# Altium project Solenoid-Switching-Board-v1.0.PrjPcb (part 2 of 5)

## Sheet Controller_Sheet.SchDoc
size 420 x 297 mm; SheetNumber: 3; SheetTotal: 9
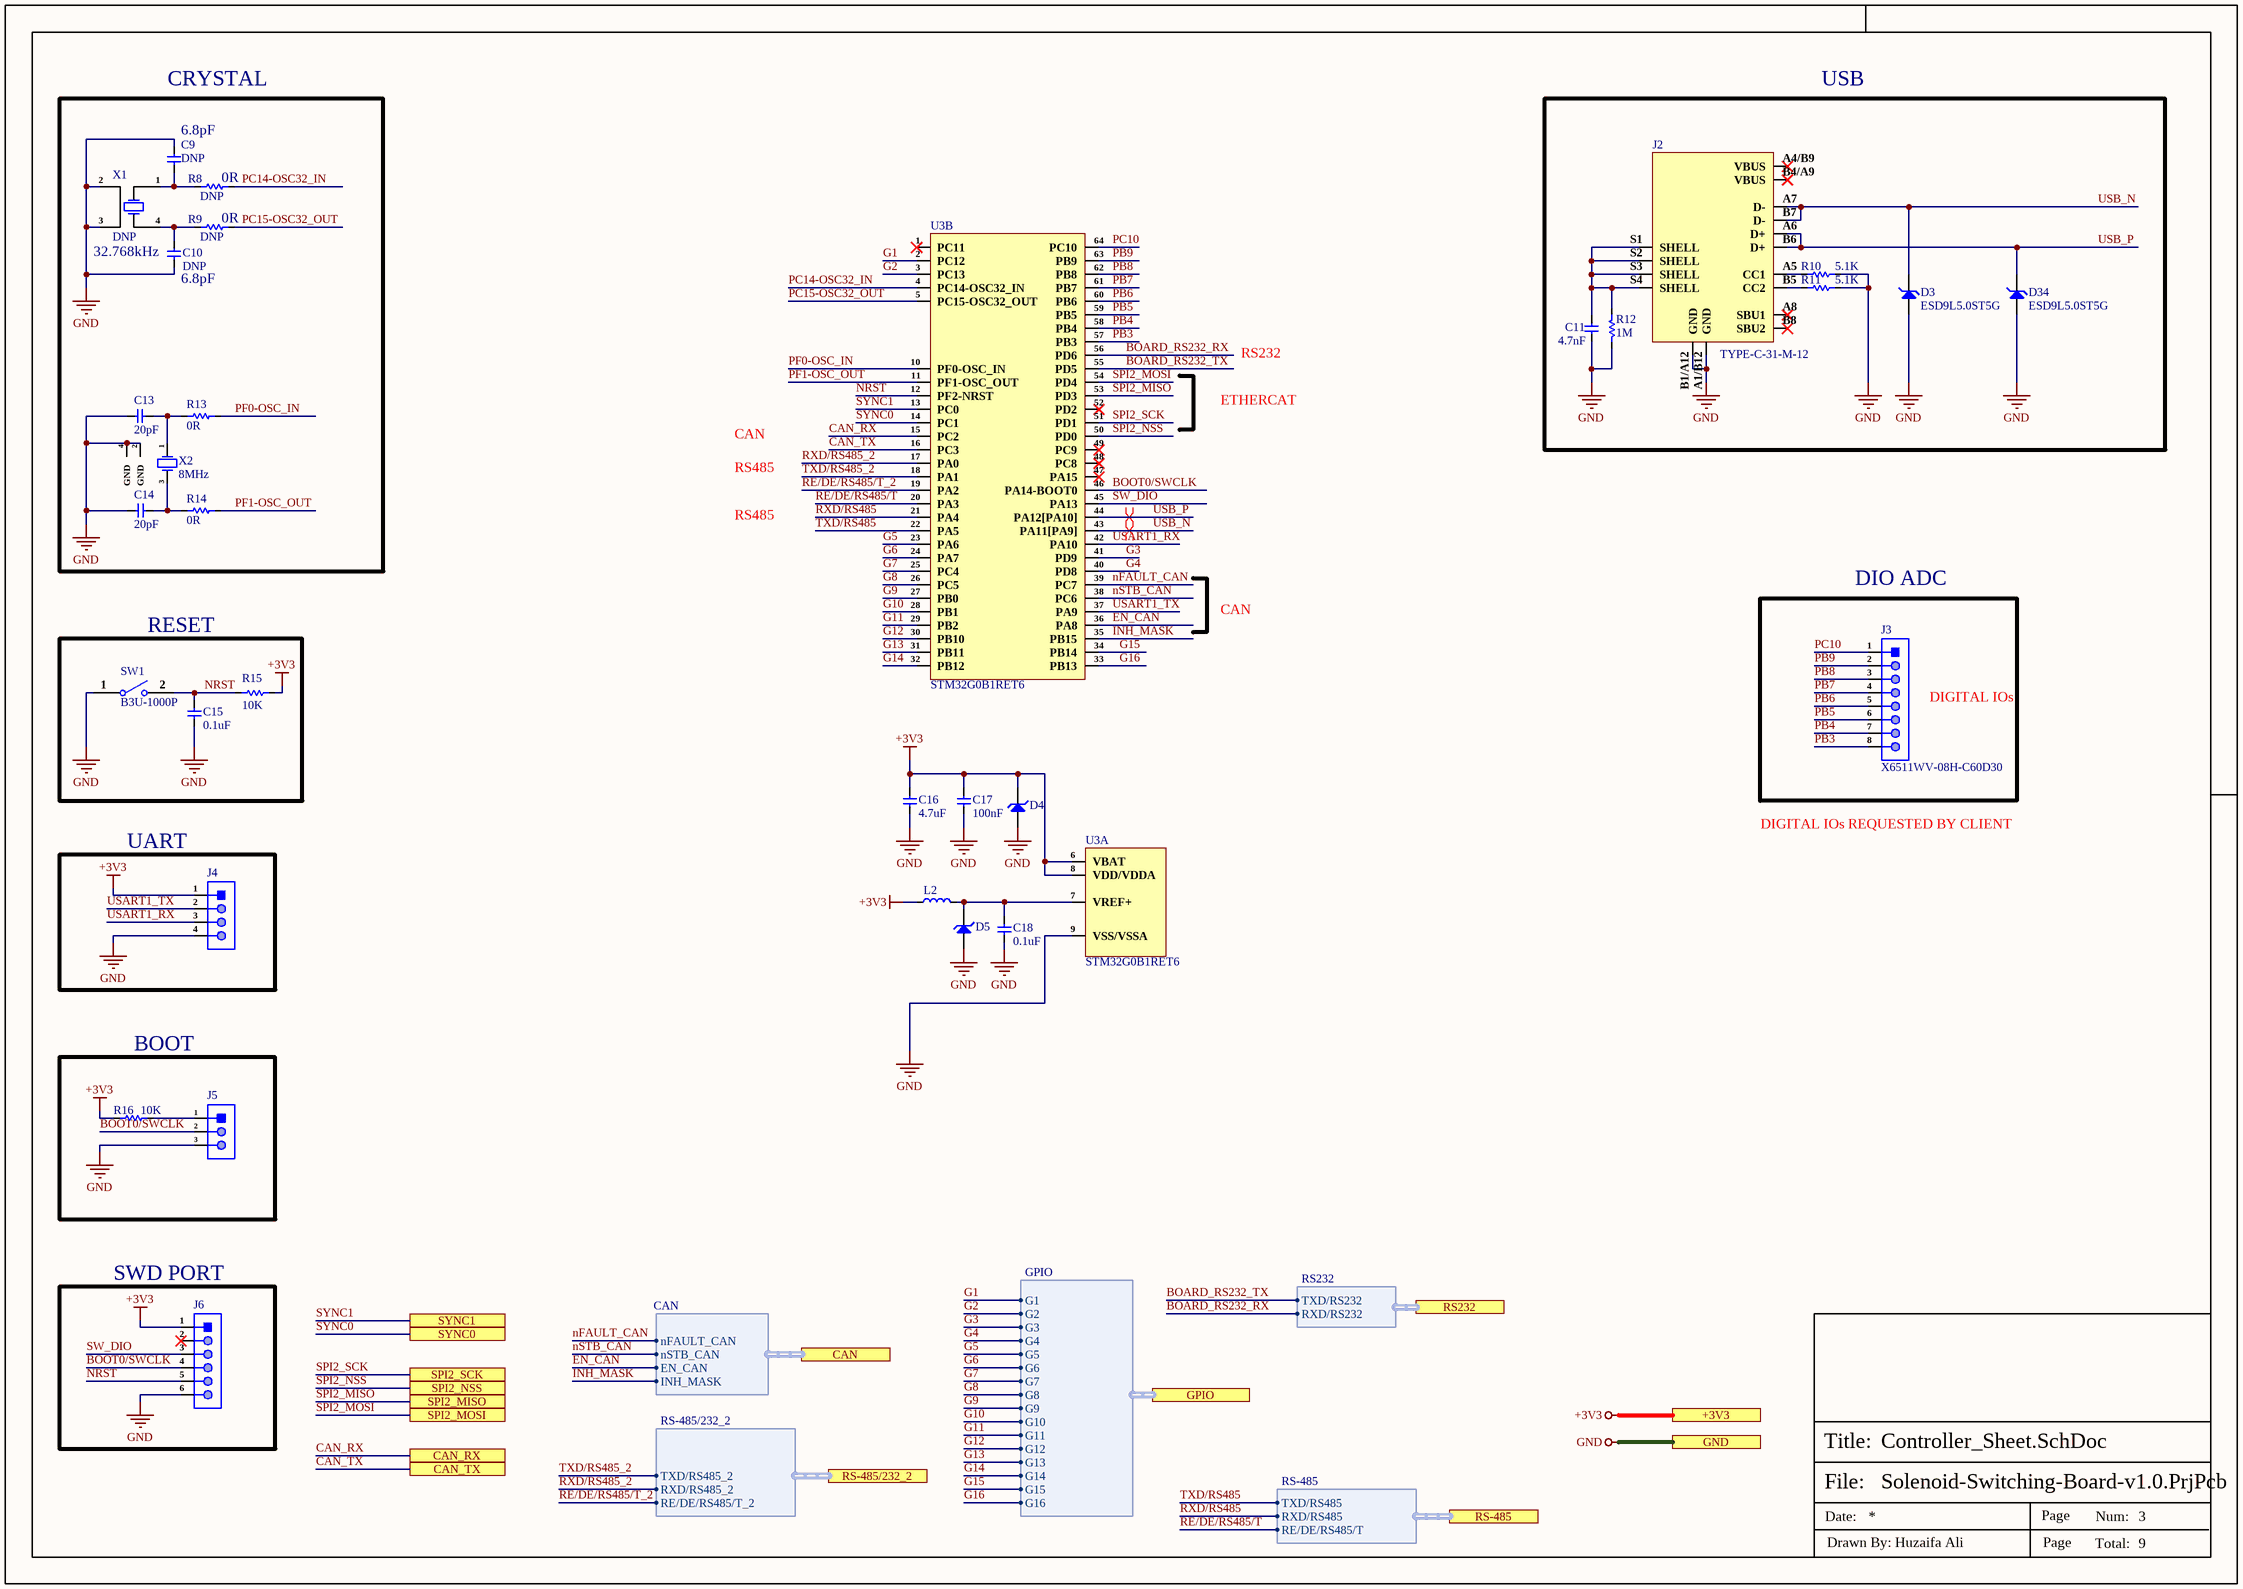
[diagram p3: Controller_Sheet.SchDoc]

### Parts
C9  DNP  [Cap-0402]
C10  DNP  [Cap-0402]
C11  4.7nF  [Cap-0603]
C13  20pF  [Cap-0402]
C14  20pF  [Cap-0402]
C15  0.1uF  [Cap-0402]
C16  4.7uF  [Cap-0402]
C17  100nF  [cap-0402]
C18  0.1uF  [Cap-0402]
D3  ESD9L5.0ST5G  [SOD-923.]
D4  AZ3003-01G  [SOD-123]  (value not drawn)
D5  AZ3003-01G  [SOD-123]  (value not drawn)
D34  ESD9L5.0ST5G  [SOD-923.]
J2  TYPE-C-31-M-12  [TYPE-C-31-M-12_]
J3  X6511WV-08H-C60D30  [HDR 1x8 TH male]
J4  X6511WV-04H-C60D30  [HDR1X4_]  (value not drawn)
J5  68000-103HLF  [HDR1X3_]  (value not drawn)
J6  X6511WV-06H-C60D30  [HDR1X6_]  (value not drawn)
L2  BLM15AG601SN1D  [IND-0402]  (value not drawn)
R8  DNP  [Res-0603]
R9  DNP  [Res-0603]
R10  5.1K  [Res-0402]
R11  5.1K  [Res-0402]
R12  1M  [Res-0402]
R13  0R  [Res-0603]
R14  0R  [Res-0603]
R15  10K  [Res-0402]
R16  10K  [Res-0402]
SW1  B3U-1000P  [B3U-1000P]
U3  STM32G0B1RET6  [LQFP-64(10x10)]  (parts A,B of 2)
X1  DNP  [MC-306]
X2  8MHz  [5TJ480000XYLBC_]

### Blocks framed on the sheet
CRYSTAL: C9 C10 C13 C14 R8 R9 R13 R14 X1 X2
USB: C11 D3 D34 J2 R10-R12
RESET: C15 R15 SW1
DIO ADC: J3
UART: J4
BOOT: J5 R16
SWD PORT: J6

### Ports
+3V3 (see Top_Sheet[3A], CAN_Sheet[5D], Connector_Sheet[5D], EtherCAT_Sheet[5D], Power_Sheet[5D], RJ45_Sheet[5D], RS485_RS232_Sheet[5D]), CAN (harness CAN, see Top_Sheet[3B], CAN_Sheet[4D]), CAN_RX (see Top_Sheet[3B], CAN_Sheet[3D]), CAN_TX (see Top_Sheet[3B], CAN_Sheet[3D]), GND (see Top_Sheet[3A], CAN_Sheet[5D], Connector_Sheet[5D], EtherCAT_Sheet[5D], MOSFET_Sheet[5D], Power_Sheet[5D], RJ45_Sheet[5D], RS485_RS232_Sheet[5D]), GPIO (harness GPIO, see Top_Sheet[3B], MOSFET_Sheet[3D]), RS232 (harness RS232, see Top_Sheet[3B], RS485_RS232_Sheet[4D]), RS-485 (harness RS-485, see Top_Sheet[3B], RS485_RS232_Sheet[4D]), RS-485/232_2 (harness RS-485/232_2, see Top_Sheet[3B], RS485_RS232_Sheet[3D]), SPI2_MISO (see Top_Sheet[3A], EtherCAT_Sheet[2D]), SPI2_MOSI (see Top_Sheet[3B], EtherCAT_Sheet[2D]), SPI2_NSS (see Top_Sheet[3A], EtherCAT_Sheet[2D]), SPI2_SCK (see Top_Sheet[3A], EtherCAT_Sheet[2D]), SYNC0 (see Top_Sheet[3B], EtherCAT_Sheet[1D]), SYNC1 (see Top_Sheet[3B], EtherCAT_Sheet[1D])

### Harnesses
RS-485/232_2: TXD/RS485_2, RXD/RS485_2, RE/DE/RS485/T_2
RS232: TXD/RS232, RXD/RS232
RS-485: TXD/RS485, RXD/RS485, RE/DE/RS485/T
CAN: nFAULT_CAN, nSTB_CAN, EN_CAN, INH_MASK
GPIO: G1, G2, G3, G4, G5, G6, G7, G8, G9, G10, G11, G12, G13, G14, G15, G16

### Nets
+3V3: C16.2 C17.2 D4.2(K) J4.1 J6.1 L2.1 R15.2 R16.2 U3.6(VBAT) U3.8(VDD/VDDA) ; port +3V3
CAN_RX: U3.15(PC2) ; port CAN_RX
CAN_TX: U3.16(PC3) ; port CAN_TX
GND: C9.1 C10.2 C11.1 C13.1 C14.2 C15.1 C16.1 C17.1 C18.1 D3.2(A) D4.1(A) D5.1(A) D34.2(A) J2.A1/B12(GND) J2.B1/A12(GND) J4.4 J5.3 J6.6 R10.2 R11.2 R12.2 SW1.1 U3.9(VSS/VSSA) X1.2 X1.3 X2.2(GND) X2.4(GND) ; port GND
RE/DE/RS485/T: U3.20(PA3) ; port RS-485.RE/DE/RS485/T
RXD/RS485: U3.21(PA4) ; port RS-485.RXD/RS485
TXD/RS485: U3.22(PA5) ; port RS-485.TXD/RS485
BOARD_RS232_RX: U3.56(PD6) ; port RS232.RXD/RS232
BOARD_RS232_TX: U3.55(PD5) ; port RS232.TXD/RS232
BOOT0/SWCLK: J5.2 J6.4 U3.46(PA14-BOOT0)
EN_CAN: U3.36(PA8) ; port CAN.EN_CAN
G1: U3.2(PC12) ; port GPIO.G1
G2: U3.3(PC13) ; port GPIO.G2
G3: U3.41(PD9) ; port GPIO.G3
G4: U3.40(PD8) ; port GPIO.G4
G5: U3.23(PA6) ; port GPIO.G5
G6: U3.24(PA7) ; port GPIO.G6
G7: U3.25(PC4) ; port GPIO.G7
G8: U3.26(PC5) ; port GPIO.G8
G9: U3.27(PB0) ; port GPIO.G9
G10: U3.28(PB1) ; port GPIO.G10
G11: U3.29(PB2) ; port GPIO.G11
G12: U3.30(PB10) ; port GPIO.G12
G13: U3.31(PB11) ; port GPIO.G13
G14: U3.32(PB12) ; port GPIO.G14
G15: U3.34(PB14) ; port GPIO.G15
G16: U3.33(PB13) ; port GPIO.G16
INH_MASK: U3.35(PB15) ; port CAN.INH_MASK
nFAULT_CAN: U3.39(PC7) ; port CAN.nFAULT_CAN
NRST: C15.2 J6.5 R15.1 SW1.2 U3.12(PF2-NRST)
nSTB_CAN: U3.38(PC6) ; port CAN.nSTB_CAN
PB3: J3.8 U3.57(PB3)
PB4: J3.7 U3.58(PB4)
PB5: J3.6 U3.59(PB5)
PB6: J3.5 U3.60(PB6)
PB7: J3.4 U3.61(PB7)
PB8: J3.3 U3.62(PB8)
PB9: J3.2 U3.63(PB9)
PC10: J3.1 U3.64(PC10)
PC14-OSC32_IN: R8.2 U3.4(PC14-OSC32_IN)
PC15-OSC32_OUT: R9.2 U3.5(PC15-OSC32_OUT)
PF0-OSC_IN: R13.2 U3.10(PF0-OSC_IN)
PF1-OSC_OUT: R14.2 U3.11(PF1-OSC_OUT)
RE/DE/RS485/T_2: U3.19(PA2) ; port RS-485/232_2.RE/DE/RS485/T_2
RXD/RS485_2: U3.17(PA0) ; port RS-485/232_2.RXD/RS485_2
SPI2_MISO: U3.53(PD3) ; port SPI2_MISO
SPI2_MOSI: U3.54(PD4) ; port SPI2_MOSI
SPI2_NSS: U3.50(PD0) ; port SPI2_NSS
SPI2_SCK: U3.51(PD1) ; port SPI2_SCK
SW_DIO: J6.3 U3.45(PA13)
SYNC0: U3.14(PC1) ; port SYNC0
SYNC1: U3.13(PC0) ; port SYNC1
TXD/RS485_2: U3.18(PA1) ; port RS-485/232_2.TXD/RS485_2
USART1_RX: J4.3 U3.42(PA10)
USART1_TX: J4.2 U3.37(PA9)
USB_N: D3.1(K) J2.A7(D-) J2.B7(D-) U3.43(PA11[PA9])
USB_P: D34.1(K) J2.A6(D+) J2.B6(D+) U3.44(PA12[PA10])
NetC9_2: C9.2 R8.1 X1.1(OSC1)
NetC10_1: C10.1 R9.1 X1.4(OSC2)
NetC11_2: C11.2 J2.S1(SHELL) J2.S2(SHELL) J2.S3(SHELL) J2.S4(SHELL) R12.1
NetC13_2: C13.2 R13.1 X2.1(OSC1)
NetC14_1: C14.1 R14.1 X2.3(OSC2)
NetC18_2: C18.2 D5.2(K) L2.2 U3.7(VREF+)
NetJ2_A5: J2.A5(CC1) R10.1
NetJ2_B5: J2.B5(CC2) R11.1
NetJ5_1: J5.1 R16.1

Not connected (* = marked no-connect by the designer): J2 A4/B9(VBUS)* A8(SBU1)* B4/A9(VBUS)* B8(SBU2)*; J6 2*; U3 1(PC11)* 47(PA15)* 48(PC8)* 49(PC9)* 52(PD2)*

### Layout directives
differential pair; net class USB_PROGRAM; differential pair class USB_PROGRAM_LINES; rule Impedance Constraint [Min = 85.00    Max = 90.00    ]; rule Matched Net Lengths [Tolerance = 50mil]: USB_N, USB_P

### Notes on the sheet
- (near C9) 6.8pF
- (near R8) 0R
- 32.768kHz
- (near R9) 0R
- (near C10) 6.8pF
- RS232
- CAN
- ETHERCAT
- RS485
- (near J3) DIGITAL IOs
- DIGITAL IOs REQUESTED BY CLIENT
- File:
- Title:
- Date:
- Page
- Num:
- Total:
- Drawn By: Huzaifa Ali

### Library data of the parts
C9 C10 = CC0402CRNPO9BN6R8: CAP CER 6.8PF 50V C0G/NPO 0402; Manufacturer: Yageo; Dielectric: C0G; Tolerance: 2%; Insulation Resistance: 10GR; Item Type: Capacitor; Supplier: Future Electronics; Supplier Part Number: 3247368; Manufacturer Part Number: CC0402CRNPO9BN6R8; RoHS: Yes; Category: Ceramic Capacitors; Stock: 200000; Pricing: 10000=0.0024, 40000=0.0022, 150000=0.0021, 400000=0.002, 1000000=0.0019 (USD); Mounting Technology: Surface Mount; Case/Package: 0402; Case Code (Imperial): 0402; Case Code (Metric): 1005; Weight: 2.3E-05oz; Min Operating Temperature: -55°C; Max Operating Temperature: 125°C; Value: 6.8pF; Packaging: Tape and Reel; Voltage Rating: 50V; Voltage Rating (DC): 50V; Termination: SMD/SMT; Series: CC; Construction: Flat; Length: 1mm; Width: 0.5mm; Height: 0.5mm; Depth: 0.5mm; Radiation Hardening: No; RoHS Compliant: Yes; ComponentLink1URL: https://datasheet.ciiva.com/11587/upy-gp-np0-16v-to-50v-8-11587182.pdf?src-supplier=Avnet; ComponentLink1Description: https://datasheet.ciiva.com/11587/upy-gp-np0-16v-to-50v-8-11587182.pdf?src-supplier=Avnet; LCSC Part Number: C189470
C11 = CC0603JRNPO9BN472: CAP CER 4700PF 50V C0G/NPO 0603; Manufacturer: Yageo; Item Type: Capacitor; Supplier 1: Digi-Key; Manufacturer Part Number: CC0603JRNPO9BN472; RoHS: Yes; Category: Ceramic Capacitors; Stock 1: 31779; Pricing 1: 1=0.48000, 10=0.33000, 50=0.23100, 100=0.19800, 500=0.14854, 1000=0.12543 (USD); RoHS Compliant: Yes; Supplier Part Number 1: 13-CC0603JRNPO9BN472CT-ND; LCSC Part Number: C576818; ComponentLink1Description: LCSC; ComponentLink1URL: https://www.lcsc.com/product-detail/Multilayer-Ceramic-Capacitors-MLCC-SMD-SMT_YAGEO-CC0603JRNPO9BN472_C576818.html
C13 C14 = CC0402JRNPO9BN200: CAP CER 20PF 50V C0G/NPO 0402; Manufacturer: Yageo; Item Type: Capacitor; Temperature Coefficient: 30ppm/°C; Supplier: Avnet; LCSC Part Number: C107000; Manufacturer Part Number: CC0402JRNPO9BN200; RoHS: Yes; Stock: 20000; Pricing: 10000=0.00221 (USD); Halogen Free: 5694HalogenFree; ComponentLink1URL: https://datasheet.ciiva.com/176/mlccorderingcode-176360.pdf?src-supplier=Digikey; ComponentLink1Description: https://datasheet.ciiva.com/176/mlccorderingcode-176360.pdf?src-supplier=Digikey; ComponentLink2URL: https://datasheet.ciiva.com/176/mlccorderingcode-176361.pdf?src-supplier=Digikey; ComponentLink2Description: https://datasheet.ciiva.com/176/mlccorderingcode-176361.pdf?src-supplier=Digikey; ComponentLink3URL: https://datasheet.ciiva.com/176/mlccorderingcode-176362.pdf?src-supplier=Digikey; ComponentLink3Description: https://datasheet.ciiva.com/176/mlccorderingcode-176362.pdf?src-supplier=Digikey; ComponentLink4URL: https://datasheet.ciiva.com/7656/1132289-7656614.pdf?src-supplier=Element14; ComponentLink4Description: https://datasheet.ciiva.com/7656/1132289-7656614.pdf?src-supplier=Element14; ComponentLink5URL: https://datasheet.ciiva.com/5427/upy-gp-np0-16v-to-50v-8-3714-5427769.pdf?src-supplier=Mouser; ComponentLink5Description: https://datasheet.ciiva.com/5427/upy-gp-np0-16v-to-50v-8-3714-5427769.pdf?src-supplier=Mouser
C15 C18 = CC0402JRX7R7BB104: CAP CER 0.1UF 16V X7R 0402; Manufacturer: Yageo; Material: 4241ConductorMaterial; Value: 100nF; Tolerance: 5%; Item Type: Capacitor; Supplier: Digikey; Supplier Part Number: 311-1676-1-ND; Manufacturer Part Number: CC0402JRX7R7BB104; RoHS: Yes; Category: Ceramic Capacitors; Stock: 1659111; Pricing: 1=0.1, 10=0.046, 50=0.0262, 100=0.0203, 500=0.01528, 1000=0.012, 2500=0.01091, 5000=0.01004 (USD); Mounting Technology: Surface Mount; Case/Package: 0402; Case Code (Metric): 1005; Case Code (Imperial): 0402; Min Operating Temperature: -55°C; Max Operating Temperature: 125°C; Dielectric: X7R; Packaging: Tape and Reel; Package Quantity: 10000; Voltage Rating (DC): 16V; Voltage Rating: 16V; Series: CC; Construction: Flat; Length: 0.039inch; Width: 0.02inch; Height: 0.5mm; Thickness: 0.022inch; Lead Free: Lead Free; Halogen Free: Halogen Free; RoHS Compliant: Yes; ComponentLink1URL: https://datasheet.ciiva.com/13210/upy-gphc-x7r-6-3v-to-50v-8-12304-13210152.pdf?src-supplier=Mouser; ComponentLink1Description: https://datasheet.ciiva.com/13210/upy-gphc-x7r-6-3v-to-50v-8-12304-13210152.pdf?src-supplier=Mouser; LCSC Part Number: C541464
C16 = CC0402KRX5R6BB475: CAP CER 4.7UF 10V X5R 0402; Manufacturer: Yageo; Tolerance: 10%; Supplier 1: Farnell; Manufacturer Part Number: CC0402KRX5R6BB475; RoHS: Yes; Category: Ceramic Capacitors; Stock 1: 20000; Pricing 1: 10000=0.02310, 50000=0.02100 (GBP); Mount: Surface Mount; Case/Package: 0402; Case Code (Imperial): 0402; Case Code (Metric): 1005; Min Operating Temperature: -55°C; Max Operating Temperature: 85°C; Packaging: Cut Tape; Capacitance: 4.7uF; Voltage Rating: 10V; RoHS Compliant: Yes; ComponentLink1URL: http://www.yageo.com/documents/recent/UPY-GPHC_X5R_4V-to-50V_25.pdf?src-supplier=Digi-Key; ComponentLink1Description: http://www.yageo.com/documents/recent/UPY-GPHC_X5R_4V-to-50V_25.pdf?src-supplier=Digi-Key; Supplier Part Number 1: 3871698; LCSC Part Number: C326586
C17 = C1005X7R1H104KT000F: CAP CER 0.1UF 50V X7R 0402; Manufacturer: TDK; Tolerance: 10%; Voltage: 25V; Item Type: Capacitor; Supplier 1: Avnet; Manufacturer Part Number: C1005X7R1H104KT000F; RoHS: No; Category: Ceramic Capacitors; Dielectric: X7R; Supplier Part Number 1: C1005X7R1H104KT000F; LCSC Part Number: C361198; ComponentLink1Description: LCSC; ComponentLink1URL: https://www.lcsc.com/product-detail/Multilayer-Ceramic-Capacitors-MLCC-SMD-SMT_TDK-C1005X7R1H104KT000F_C361198.html
D3 D34 = ESD9L5.0ST5G: TVS DIODE 5V 9.8V SOD923; Manufacturer: ON Semiconductor; Capacitance: 0.9pF; Direction: Unidirectional; Number of Unidirectional Channels: 1; Min Breakdown Voltage: 5.4V; Power Line Protection: No; Leakage Current: 1uA; Element Configuration: Single; Peak Pulse Current: 1A; Diode Type: ZENER; Reverse Breakdown Voltage: 5.8V; Peak Pulse Power: 150mW; ESD Protection: Yes; Test Current: 1mA; Supplier 1: Digi-Key; Manufacturer Part Number: ESD9L5.0ST5G; RoHS: Yes; Category: ESD and Circuit Protection ICs; Stock 1: 558996; Pricing 1: 1=0.37000, 10=0.25600, 100=0.12500, 500=0.10426, 1000=0.07244, 2000=0.06278 (USD); Case/Package: SOD-923-2; Number of Pins: 2; Contact Plating: Tin,Matte; Min Operating Temperature: -55°C; Max Operating Temperature: 150°C; Package Quantity: 1; Packaging: Tape and Reel; Clamping Voltage: 9.8V; Reverse Standoff Voltage: 5V; Working Voltage: 5V; Resistor Type: Zener; Series: Automotive, AEC-Q101; Number of Elements: 1; Operating Supply Voltage: 5V; Max Surge Current: 1A; Breakdown Voltage: 5.4V; Number of Channels: 1; Polarity: Unidirectional; Termination: SMD/SMT; Max Reverse Leakage Current: 1uA; Max Breakdown Voltage: 5.4V; Number of Lines: 1; Power Dissipation: 150mW; Clamping Voltage-Max: 9.8V; Length: 0.8mm; Width: 0.65mm; Height: 0.4mm; Depth: 0.6mm; Radiation Hardening: No; Lead Free: Lead Free; RoHS Compliant: Yes; REACH SVHC: No SVHC; Halogen Free: Halogen Free; ComponentLink1URL: https://datasheet.ciiva.com/15143/getdatasheetpartid-185186-15143896.pdf?src-supplier=Verical; ComponentLink1Description: https://datasheet.ciiva.com/15143/getdatasheetpartid-185186-15143896.pdf?src-supplier=Verical; ComponentLink2URL: https://datasheet.ciiva.com/4510/esd9l-d-4510647.pdf?src-supplier=Mouser; ComponentLink2Description: https://datasheet.ciiva.com/4510/esd9l-d-4510647.pdf?src-supplier=Mouser; ComponentLink3URL: https://datasheet.ciiva.com/3304/esd9l-d-3304011.pdf?src-supplier=Avnet; ComponentLink3Description: https://datasheet.ciiva.com/3304/esd9l-d-3304011.pdf?src-supplier=Avnet; ComponentLink4URL: https://datasheet.ciiva.com/16437/esd9l-d-16437835.pdf?src-supplier=Future+Electronics; ComponentLink4Description: https://datasheet.ciiva.com/16437/esd9l-d-16437835.pdf?src-supplier=Future+Electronics; ComponentLink5URL: https://datasheet.ciiva.com/339/esd9l-d-339853.pdf?src-supplier=Digi-Key; ComponentLink5Description: https://datasheet.ciiva.com/339/esd9l-d-339853.pdf?src-supplier=Digi-Key; ComponentLink6URL: https://datasheet.ciiva.com/339/esd9l-d-339854.pdf?src-supplier=Digi-Key; ComponentLink6Description: https://datasheet.ciiva.com/339/esd9l-d-339854.pdf?src-supplier=Digi-Key; ComponentLink7URL: https://datasheet.ciiva.com/11195/esd9l-d-11195342.pdf?src-supplier=Avnet; ComponentLink7Description: https://datasheet.ciiva.com/11195/esd9l-d-11195342.pdf?src-supplier=Avnet; ComponentLink8URL: https://datasheet.ciiva.com/25958/esd9l-d-25958446.pdf?src-supplier=Avnet+Europe; ComponentLink8Description: https://datasheet.ciiva.com/25958/esd9l-d-25958446.pdf?src-supplier=Avnet+Europe; ComponentLink9URL: https://datasheet.ciiva.com/339/esd9l-d-339855.pdf?src-supplier=Digi-Key; ComponentLink9Description: https://datasheet.ciiva.com/339/esd9l-d-339855.pdf?src-supplier=Digi-Key; Supplier Part Number 1: ESD9L5.0ST5GOSCT-ND; LCSC Part Number: C82326
D4 D5 = AZ3003-01G: TVS SURGE PROTECTOR 1-CH 3.3V; Manufacturer: Amazing; Item Type: Diode; Manufacturer Part Number: AZ3003-01G; Package: SOD-123; LCSC Part Number: -; ComponentLink1Description: Digikey; ComponentLink1URL: https://www.digikey.com/en/products/detail/amazing/AZ3003-01G/16615352?s=N4IgTCBcDaIIIC0DMAGFSC0KCMBxEAugL5A
J2 = TYPE-C-31-M-12: 5A 1 16P Female Type-C SMD USB Connectors ROHS; Manufacturer: Korean Hroparts Elec; ComponentLink1Description: LCSC; ComponentLink1URL: https://www.lcsc.com/product-detail/USB-Connectors_Korean-Hroparts-Elec-TYPE-C-31-M-12_C165948.html; Manufacturer Part Number: TYPE-C-31-M-12; Footprint: Custom; LCSC Part Number: C165948; Item Type: USB Connector
J3 = X6511WV-08H-C60D30: Gold 250V 3A Square Pins 2.5mm 8P 260℃ 6mm -40℃~+105℃ 3mm 2.54mm Plugin Black Brass 2.54mm 1x8P Plugin,P=2.54mm Pin Headers ROHS; Manufacturer: XKB; Item Type: Male Header; Manufacturer Part Number: X6511WV-08H-C60D30; Package: Plugin,P=2.54mm; LCSC Part Number: C706880; ComponentLink1Description: LCSC; ComponentLink1URL: https://www.lcsc.com/product-detail/Pin-Headers_XKB-Connection-X6511WV-08H-C60D30_C706880.html
J4 = X6511WV-04H-C60D30: Gold 250V 3A Straight Square Pins 2.5mm 4P 260℃ 6mm -40℃~+105℃ 3mm 2.54mm Plugin Black Brass 1x4P Plugin,P=2.54mm Pin Headers ROHS; Manufacturer: XKB; Item Type: Male Header; ComponentLink1Description: LCSC; ComponentLink1URL: https://www.lcsc.com/product-detail/Pin-Headers_XKB-Connectivity-X6511WV-04H-C60D30_C706876.html; Manufacturer Part Number: X6511WV-04H-C60D30; Package: Plugin,P=2.54mm; LCSC Part Number: C706876
J5 = 68000-103HLF: CONN HEADER VERT 3POS 2.54MM; Item Type: Male Header; Number of Positions: 3; Current Rating: 3A; Insulation Resistance: 5GR; Voltage Rating: 1.5kV; Contact Post Length: 2.41mm; LCSC Part Number: C168677; ComponentLink1Description: LCSC; Supplier: Avnet; Supplier Part Number: 88K1775; RoHS: No; Category: Headers and Wire Housings; Stock: 2805; Pricing: 1=0.395, 10=0.31, 25=0.29, 50=0.27, 100=0.25 (USD); Contact Plating: Gold,GXT; Contact Material: Bronze; Housing Material: Thermoplastic; Housing Color: Black; Min Operating Temperature: -65°C; Max Operating Temperature: 125°C; Number of Rows: 1; Termination: Through Hole; Packaging: Bulk; Number of Contacts: 3; Contact Gender: Male; Orientation: Straight; Max Voltage Rating (AC): 1.5kV; Package Quantity: 100; Series: 68000; Length: 7.62mm; Pitch: 2.54mm; Contact Mating Length: 5.84mm; Depth: 2.41mm; Radiation Hardening: No; Flammability Rating: UL94 V-0; Reach SVHC Compliant: No; ComponentLink2URL: https://datasheet.ciiva.com/46392/1914865-46392021.pdf?src-supplier=Element14; ComponentLink2Description: https://datasheet.ciiva.com/46392/1914865-46392021.pdf?src-supplier=Element14
J6 = X6511WV-06H-C60D30: Gold 250V 3A Straight Square Pins 2.5mm 6P 260℃ 6mm -40℃~+105℃ 3mm 2.54mm Plugin Black Brass 1x6P Plugin,P=2.54mm Pin Headers ROHS; Manufacturer: XKB; Item Type: Male Header; Manufacturer Part Number: X6511WV-06H-C60D30; Package: Plugin,P=2.54mm; LCSC Part Number: C706878; ComponentLink1Description: LCSC; ComponentLink1URL: https://www.lcsc.com/product-detail/Pin-Headers_XKB-Connectivity-X6511WV-06H-C60D30_C706878.html
L2 = BLM15AG601SN1D: FERRITE BEAD 600 OHM 0402 1LN; Manufacturer: Murata; Material: Steel,Ferrite; Impedance: 600R; Tolerance: 25%; Max DC Current: 300mA; DC Resistance (DCR): 520mR; Test Frequency: 100MHz; Number of Lines: 1; Shielding: Unshielded; DC Resistance-Max: 600mR; Supplier 1: Digi-Key; Manufacturer Part Number: BLM15AG601SN1D; RoHS: Yes; Category: Inductors; Stock 1: 4108655; Pricing 1: 1=0.10000, 10=0.06500, 25=0.05760, 50=0.05240, 100=0.04710, 250=0.03456, 500=0.02514, 1000=0.02461, 5000=0.01676 (USD); Case/Package: 0402; Number of Pins: 2; Core Material: Ferrite; Case Code (Metric): 1005; Case Code (Imperial): 0402; Min Operating Temperature: -55°C; Max Operating Temperature: 125°C; Package Quantity: 10000; Packaging: Tape and Reel; Current Rating: 300mA; Max Current Rating: 300mA; Termination: SMD/SMT; DC Current: 300mA; Frequency: 100MHz; Number of Circuits: 1; Series: BLM15AG_SN; Length: 1mm; Width: 0.5mm; Height: 0.5mm; Depth: 0.55mm; Radiation Hardening: No; REACH SVHC: No SVHC; Military Standard: Not; Lead Free: Lead Free; RoHS Compliant: Yes; ComponentLink1URL: https://datasheet.ciiva.com/11799/0900766b811b5866-11799226.pdf?src-supplier=RSComponents; ComponentLink1Description: https://datasheet.ciiva.com/11799/0900766b811b5866-11799226.pdf?src-supplier=RSComponents; ComponentLink2URL: https://datasheet.ciiva.com/41449/001172163-da-01-en-drossel-0402-600r-1-0x0-5mm-10000st-41449450.pdf?src-supplier=Conrad; ComponentLink2Description: https://datasheet.ciiva.com/41449/001172163-da-01-en-drossel-0402-600r-1-0x0-5mm-10000st-41449450.pdf?src-supplier=Conrad; ComponentLink3URL: https://datasheet.ciiva.com/29347/442210-da-01-en-chip-drossel-0402-600r-300ma-1-0x0-5mm-29347879.pdf?src-supplier=Conrad; ComponentLink3Description: https://datasheet.ciiva.com/29347/442210-da-01-en-chip-drossel-0402-600r-300ma-1-0x0-5mm-29347879.pdf?src-supplier=Conrad; ComponentLink4URL: https://datasheet.ciiva.com/1466/5144-1466744.pdf?src-supplier=Element14; ComponentLink4Description: https://datasheet.ciiva.com/1466/5144-1466744.pdf?src-supplier=Element14; ComponentLink5URL: https://datasheet.ciiva.com/1466/5144-1466745.pdf?src-supplier=Element14; ComponentLink5Description: https://datasheet.ciiva.com/1466/5144-1466745.pdf?src-supplier=Element14; ComponentLink6URL: https://datasheet.ciiva.com/14122/blm-series-eng-tds-14122894.pdf?src-supplier=Distrelec; ComponentLink6Description: https://datasheet.ciiva.com/14122/blm-series-eng-tds-14122894.pdf?src-supplier=Distrelec; ComponentLink7URL: https://datasheet.ciiva.com/6212/l0110s0100blm15ag-sn-6212519.pdf?src-supplier=Digi-Key; ComponentLink7Description: https://datasheet.ciiva.com/6212/l0110s0100blm15ag-sn-6212519.pdf?src-supplier=Digi-Key; ComponentLink8URL: https://datasheet.ciiva.com/6212/l0110s0100blm15ag-sn-6212565.pdf?src-supplier=Digi-Key; ComponentLink8Description: https://datasheet.ciiva.com/6212/l0110s0100blm15ag-sn-6212565.pdf?src-supplier=Digi-Key; ComponentLink9URL: https://datasheet.ciiva.com/6212/l0110s0100blm15ag-sn-6212520.pdf?src-supplier=Digi-Key; ComponentLink9Description: https://datasheet.ciiva.com/6212/l0110s0100blm15ag-sn-6212520.pdf?src-supplier=Digi-Key; ComponentLink10URL: https://datasheet.ciiva.com/8084/l0110s0100blm15ag-sn-8084271.pdf?src-supplier=Avnet; ComponentLink10Description: https://datasheet.ciiva.com/8084/l0110s0100blm15ag-sn-8084271.pdf?src-supplier=Avnet; ComponentLink11URL: https://datasheet.ciiva.com/8510/l0110s0100blm15ag-sn-8510909.pdf?src-supplier=Avnet; ComponentLink11Description: https://datasheet.ciiva.com/8510/l0110s0100blm15ag-sn-8510909.pdf?src-supplier=Avnet; Supplier Part Number 1: 490-1006-1-ND; LCSC Part Number: C76884; Item Type: Ferrite Bead
R8 R9 R13 R14 = RC0603JR-070RL: RES 0 OHM JUMPER 1/10W 0603; Manufacturer: Yageo; Resistance: 0mR; Tolerance: 1%; Power Rating: 100mW; Voltage Rating (DC): 50V; Temperature Coefficient: 200ppm/°C; Resistance Tolerance: 5%; Item Type: Resistor; Supplier 1: Digi-Key; Manufacturer Part Number: RC0603JR-070RL; RoHS: Yes; Category: Chip SMD Resistors; Stock 1: 18081776; Pricing 1: 1=0.10000, 10=0.01700, 25=0.01240, 50=0.00960, 100=0.00700, 250=0.00536, 500=0.00430, 1000=0.00316 (USD); Case/Package: 0603; Number of Pins: 2; Contact Plating: Tin,Matte; Case Code (Imperial): 0603; Case Code (Metric): 1608; Size Code: 0603; Min Operating Temperature: -55°C; Max Operating Temperature: 155°C; Resistor Type: Thick Film; Packaging: Tape and Reel; Termination: SMD/SMT; Series: RC; Technology: THICK FILM; Package Quantity: 5000; Voltage Rating: 50V; Features: Moisture Resistant; Max Power Dissipation: 100mW; Number of Terminations: 2; Construction: Rectangular; Length: 1.6mm; Width: 0.8mm; Height: 0.45mm; Depth: 0.8mm; Radiation Hardening: No; Reach SVHC Compliant: No SVHC; Lead Free: Lead Free; RoHS Compliant: Yes; Military Standard: Not; Supplier Part Number 1: 311-0.0GRCT-ND; LCSC Part Number: C95177
R10 R11 = RC0402FR-075K1L: RES 5.1K OHM 1% 1/16W 0402; Manufacturer: Yageo; Power Rating: 63mW; Resistance: 5.1kR; Temperature Coefficient: 100ppm/°C; Voltage Rating: 50V; Item Type: Resistor; Supplier 1: Avnet; Manufacturer Part Number: RC0402FR-075K1L; RoHS: Yes; Category: Chip SMD Resistors; Stock 1: 65000; Pricing 1: 10000=0.00085 (USD); Case/Package: 0402; Case Code (Metric): 1005; Case Code (Imperial): 0402; Min Operating Temperature: -55°C; Max Operating Temperature: 155°C; Tolerance: 1%; Technology: THICK FILM; Packaging: Tape and Reel; Package Quantity: 1; Resistor Type: Thick Film; Number of Terminations: 2; Termination: SMD/SMT; Max Power Dissipation: 63mW; Voltage Rating (DC): 50V; Working Voltage: 50V; Features: Moisture Resistant; Series: RC; Resistance Tolerance: 1%; Construction: Rectangular; Length: 1mm; Width: 0.02inch; Height: 0.016inch; Depth: 0.5mm; RoHS Compliant: Yes; Military Standard: Not; Lead Free: Lead Free; ComponentLink1URL: https://datasheet.ciiva.com/7983/1018594-7983519.pdf?src-supplier=Element14; ComponentLink1Description: https://datasheet.ciiva.com/7983/1018594-7983519.pdf?src-supplier=Element14; ComponentLink2URL: https://datasheet.ciiva.com/46394/1018594-46394936.pdf?src-supplier=Element14; ComponentLink2Description: https://datasheet.ciiva.com/46394/1018594-46394936.pdf?src-supplier=Element14; ComponentLink3URL: https://datasheet.ciiva.com/2453/pyu-r-int-thick-7-2453401.pdf?src-supplier=Digi-Key; ComponentLink3Description: https://datasheet.ciiva.com/2453/pyu-r-int-thick-7-2453401.pdf?src-supplier=Digi-Key; ComponentLink4URL: https://datasheet.ciiva.com/2453/pyu-r-int-thick-7-2453402.pdf?src-supplier=Digi-Key; ComponentLink4Description: https://datasheet.ciiva.com/2453/pyu-r-int-thick-7-2453402.pdf?src-supplier=Digi-Key; ComponentLink5URL: https://datasheet.ciiva.com/2453/pyu-r-int-thick-7-2453400.pdf?src-supplier=Digi-Key; ComponentLink5Description: https://datasheet.ciiva.com/2453/pyu-r-int-thick-7-2453400.pdf?src-supplier=Digi-Key; ComponentLink6URL: https://datasheet.ciiva.com/12558/pyu-rc0402-51-rohs-l-6-r-8721-12558460.pdf?src-supplier=Mouser; ComponentLink6Description: https://datasheet.ciiva.com/12558/pyu-rc0402-51-rohs-l-6-r-8721-12558460.pdf?src-supplier=Mouser; ComponentLink7URL: https://datasheet.ciiva.com/16744/pyu-rc0402-51-rohs-l-6-r-16744283.pdf?src-supplier=Future+Electronics; ComponentLink7Description: https://datasheet.ciiva.com/16744/pyu-rc0402-51-rohs-l-6-r-16744283.pdf?src-supplier=Future+Electronics; ComponentLink8URL: https://datasheet.ciiva.com/15189/getdatasheetpartid-323636-15189493.pdf?src-supplier=Verical; ComponentLink8Description: https://datasheet.ciiva.com/15189/getdatasheetpartid-323636-15189493.pdf?src-supplier=Verical; Supplier Part Number 1: RC0402FR-075K1L; LCSC Part Number: C105872
R12 = AF0402JR-071ML: RES SMD 1M OHM 5% 1/16W 0402; Manufacturer: Yageo; Resistance: 1MR; Max Power Dissipation: 63mW; Temperature Coefficient: 100ppm/°C; Item Type: Resistor; Supplier 1: Digi-Key; Manufacturer Part Number: AF0402JR-071ML; Stock 1: 0; Pricing 1: 10000=0.00408 (USD); Case/Package: 0402; Min Operating Temperature: -55°C; Max Operating Temperature: 155°C; Packaging: Tape and Reel; Resistor Type: Thick Film; Number of Terminations: 2; Tolerance: 5%; Features: Moisture Resistant,Anti-Sulfur; Length: 0.039inch; Width: 0.02inch; Height: 0.015inch; RoHS Compliant: Yes; ComponentLink1URL: https://www.yageo.com/upload/media/product/productsearch/datasheet/rchip/PYu-AF_51_RoHS_L_6.pdf?src-supplier=Digi-Key; ComponentLink1Description: https://www.yageo.com/upload/media/product/productsearch/datasheet/rchip/PYu-AF_51_RoHS_L_6.pdf?src-supplier=Digi-Key; Supplier Part Number 1: AF0402JR-071ML-ND; LCSC Part Number: C144054
R15 R16 = RC0402FR-0710KL: RES 10K OHM 1% 1/16W 0402; Manufacturer: Yageo; Resistance: 10kR; Voltage Rating (DC): 50V; Temperature Coefficient: 100ppm/°C; Power Rating: 62.5mW; Max Power Dissipation: 63mW; Item Type: Resistor; Supplier 1: Mouser; Manufacturer Part Number: RC0402FR-0710KL; RoHS: Yes; Category: Chip SMD Resistors; Stock 1: 18648329; Pricing 1: 1=0.10000, 10=0.01400, 50=0.01400, 100=0.00500, 1000=0.00300, 10000=0.00200 (USD); Case/Package: 0402; Number of Pins: 2; Case Code (Imperial): 0402; Case Code (Metric): 1005; Min Operating Temperature: -55°C; Max Operating Temperature: 155°C; Resistor Type: Thick Film; Tolerance: 1%; Packaging: Tape and Reel; Voltage Rating: 50V; Termination: SMD/SMT; Working Voltage: 50V; Number of Terminations: 2; Features: Moisture Resistant; Series: RC; Resistance Tolerance: 1%; Construction: Rectangular; Length: 1mm; Width: 0.5mm; Height: 0.32mm; Depth: 0.5mm; Lead Pitch: 0.2mm; REACH SVHC: No SVHC; Lead Free: Lead Free; RoHS Compliant: Yes; Military Standard: Not; ComponentLink1URL: https://datasheet.ciiva.com/7660/38568-7660787.pdf?src-supplier=Element14; ComponentLink1Description: https://datasheet.ciiva.com/7660/38568-7660787.pdf?src-supplier=Element14; ComponentLink2URL: https://datasheet.ciiva.com/7849/1686128-7849814.pdf?src-supplier=Element14; ComponentLink2Description: https://datasheet.ciiva.com/7849/1686128-7849814.pdf?src-supplier=Element14; ComponentLink3URL: https://datasheet.ciiva.com/7983/1018594-7983486.pdf?src-supplier=Element14; ComponentLink3Description: https://datasheet.ciiva.com/7983/1018594-7983486.pdf?src-supplier=Element14; ComponentLink4URL: https://datasheet.ciiva.com/22747/1018594-22747512.pdf?src-supplier=Element14; ComponentLink4Description: https://datasheet.ciiva.com/22747/1018594-22747512.pdf?src-supplier=Element14; ComponentLink5URL: https://datasheet.ciiva.com/12667/pyu-rc0402-51-rohs-l-6-r-12667067.pdf?src-supplier=Mouser; ComponentLink5Description: https://datasheet.ciiva.com/12667/pyu-rc0402-51-rohs-l-6-r-12667067.pdf?src-supplier=Mouser; ComponentLink6URL: https://datasheet.ciiva.com/7849/1784430-7849813.pdf?src-supplier=Element14; ComponentLink6Description: https://datasheet.ciiva.com/7849/1784430-7849813.pdf?src-supplier=Element14; ComponentLink7URL: https://datasheet.ciiva.com/7849/1784430-7849815.pdf?src-supplier=Element14; ComponentLink7Description: https://datasheet.ciiva.com/7849/1784430-7849815.pdf?src-supplier=Element14; Supplier Part Number 1: 603-RC0402FR-0710KL; LCSC Part Number: C60490
SW1 = B3U-1000P: SWITCH TACTILE SPST-NO 0.05A 12V; Manufacturer: Omron; Mechanical Life: 200000Cycles; Operating Force: 1.5N; Throw Configuration: SPST; Current Rating: 50mA; Contact Resistance: 100mR; Illumination Type: Non-Illuminated,Illuminated; Switch Travel: 0.15mm; Switch Function: Off-Mom; Actuator Type: Standard; Actuator Length: 0.4mm; Ratings: Dust Proof,IP40; ComponentLink1URL: http://www.farnell.com/datasheets/60838.pdf?src-supplier=Farnell; ComponentLink1Description: http://www.farnell.com/datasheets/60838.pdf?src-supplier=Farnell; ComponentLink2URL: http://www.farnell.com/datasheets/60838.pdf?src-supplier=Element14; ComponentLink2Description: http://www.farnell.com/datasheets/60838.pdf?src-supplier=Element14; ComponentLink3URL: https://omronfs.omron.com/en_US/ecb/products/pdf/en-b3u.pdf?src-supplier=Digi-Key; ComponentLink3Description: https://omronfs.omron.com/en_US/ecb/products/pdf/en-b3u.pdf?src-supplier=Digi-Key; ComponentLink4URL: http://www.omron.com/ecb/products/pdf/en-b3u.pdf?src-supplier=Digi-Key; ComponentLink4Description: http://www.omron.com/ecb/products/pdf/en-b3u.pdf?src-supplier=Digi-Key; ComponentLink5URL: https://www.distrelec.biz/Web/Downloads/he/et/B3U_eng_datasheet.pdf?mime=application%2Fpdf&src-supplier=Distrelec; ComponentLink5Description: https://www.distrelec.biz/Web/Downloads/he/et/B3U_eng_datasheet.pdf?mime=application%2Fpdf&src-supplier=Distrelec; ComponentLink6URL: http://www.onlinecomponents.com/productFiles/mf-OM/en-b3u.pdf?src-supplier=Onlinecomponents.com; ComponentLink6Description: http://www.onlinecomponents.com/productFiles/mf-OM/en-b3u.pdf?src-supplier=Onlinecomponents.com; Supplier 1: Digi-Key; Manufacturer Part Number: B3U-1000P; Stock 1: 116454; Pricing 1: 1=1, 10=0.961, 25=0.9064, 50=0.7976, 100=0.7251, 250=0.68888, 500=0.67074, 1000=0.52571 (USD); Mount: Surface Mount; Weight: 0.000776oz; Contact Material: Silver; Min Operating Temperature: -25°C; Max Operating Temperature: 70°C; Packaging: Tape and Reel; Voltage Rating (DC): 12V; Package Quantity: 1; Max Current Rating: 50mA; Termination: SMD/SMT; Orientation: Straight; Max Voltage Rating (DC): 12V; Electrical Life: 200000Cycles; Insulation Resistance: 100MR; Contact Current Rating: 50mA; Length: 4mm; Height: 1.2mm; Depth: 2.5mm; Width: 3mm; REACH SVHC: Unknown; Lead Free: Lead Free; ComponentLink7URL: https://www.verical.com/server-webapp/html/getDatasheet?partID=552554&src-supplier=Verical; ComponentLink7Description: https://www.verical.com/server-webapp/html/getDatasheet?partID=552554&src-supplier=Verical; ComponentLink8URL: http://www.farnell.com/datasheets/1685550.pdf?src-supplier=Element14; ComponentLink8Description: http://www.farnell.com/datasheets/1685550.pdf?src-supplier=Element14; ComponentLink9URL: http://www.farnell.com/datasheets/2610940.pdf?src-supplier=Farnell; ComponentLink9Description: http://www.farnell.com/datasheets/2610940.pdf?src-supplier=Farnell; ComponentLink10URL: https://www.alliedelec.com/m/d/4c8a9ef82804fc3c241a13c1e298fd73.pdf?src-supplier=Allied+Electronics; ComponentLink10Description: https://www.alliedelec.com/m/d/4c8a9ef82804fc3c241a13c1e298fd73.pdf?src-supplier=Allied+Electronics; Supplier Part Number 1: SW1020DKR-ND; LCSC Part Number: C231329; Item Type: Switch
U3 = STM32G0B1RET6: IC MCU 32BIT 512KB FLASH 64LQFP; Manufacturer: STMicroelectronics; Item Type: Microcontrollers; Supplier: Future Electronics; Supplier Part Number: 4135249; Manufacturer Part Number: STM32G0B1RET6; RoHS: Yes; Stock: 320; Pricing: 160=3.74, 320=3.68, 480=3.64, 640=3.62, 800=3.54 (USD); LCSC Part Number: C2829307
X1 = MC-306 32.7680K-A0:ROHS: 32.768kHz 12.5pF ±20ppm MC-306 Crystals ROHS; Manufacturer: Seiko Epson; Value: 32.786kHz; Manufacturer Part Number: MC-306 32.7680K-A0:ROHS; Item Type: Crystal; LCSC Part Number: C2650464; ComponentLink1Description: LCSC; ComponentLink1URL: https://www.lcsc.com/product-detail/Crystals_Seiko-Epson-MC-306-32-7680K-A0-ROHS_C2650464.html
X2 = 5TJ480000XYLBC: 8MHz 18pF ±10ppm SMD5032-4P Crystals ROHS; Manufacturer: JYJE; Manufacturer Part Number: 5TJ480000XYLBC; ComponentLink1Description: LCSC; ComponentLink1URL: https://www.lcsc.com/product-detail/Crystals_JYJE-5TJ480000XYLBC_C2149247.html; Package: SMD5032-4P; LCSC Part Number: C2149247; Item Type: Crystal